# EAGLE design havits_crawdaff (EAGLE 9.6.2)
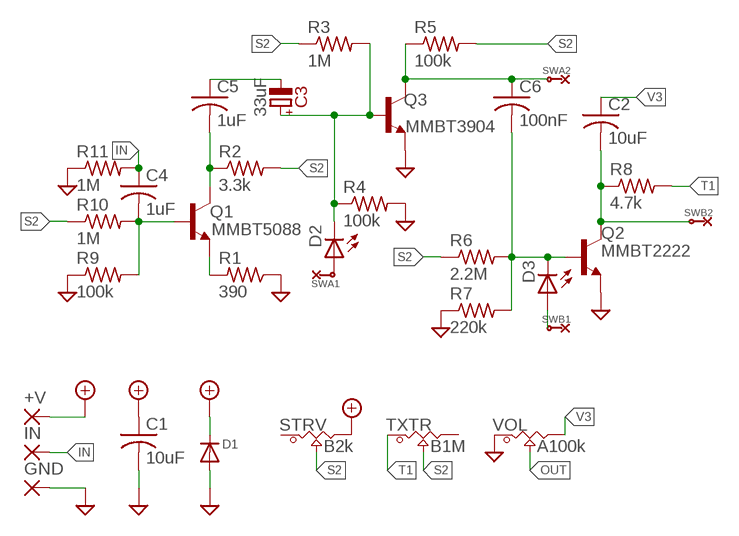
[diagram p0: schematic, sheet 1]

## Parts
+V  SMD2  [SMD1,27-2,54]
C1  10uF  C-USC1206  [C1206]
C2  10uF  C-USC1206  [C1206]
C3  33uF  PAN_B  [PAN_B]
C4  1uF  C-USC0603  [C0603]
C5  1uF  C-USC0603  [C0603]
C6  100nF  C-USC0603  [C0603]
D1  DIODESOD-123  [SOD-123]
D2  LEDCHIPLED_0603  [CHIPLED_0603]
D3  LEDCHIPLED_0603  [CHIPLED_0603]
GND  SMD2  [SMD1,27-2,54]
IN  SMD2  [SMD1,27-2,54]
Q1  MMBT5088  [SOT23-BEC]
Q2  MMBT2222  MMBT2222ALT1-NPN-SOT23-BEC  [SOT23-BEC]
Q3  MMBT3904  MMBT3904LT1G  [SOT23-3]
R1  390  R-US_R0603  [R0603]
R2  3.3k  R-US_R0603  [R0603]
R3  1M  R-US_R0603  [R0603]
R4  100k  R-US_R0603  [R0603]
R5  100k  R-US_R0603  [R0603]
R6  2.2M  R-US_R0603  [R0603]
R7  220k  R-US_R0603  [R0603]
R8  4.7k  R-US_R0603  [R0603]
R9  100k  R-US_R0603  [R0603]
R10  1M  R-US_R0603  [R0603]
R11  1M  R-US_R0603  [R0603]
STRV  B2k  POT_9MM_SMD  [POT_9MM_SMD]
SWA1  COM_SMD  [1PAD]
SWA2  COM_SMD  [1PAD]
SWB1  COM_SMD  [1PAD]
SWB2  COM_SMD  [1PAD]
TXTR  B1M  POT_9MM_SMD  [POT_9MM_SMD]
VOL  A100k  POT_9MM_SMD  [POT_9MM_SMD]

## Nets
+9V: +V.1(P) C1.1 D1.C STRV.3
GND: C1.2 D1.A GND.1(P) Q2.E Q3.2(E) R1.1 R4.2 R7.1 R9.1 R11.1 VOL.1
IN: C4.1 IN.1(P) R11.2
N$2: D3.A SWB1.1
N$4: C3.2-(-) C5.1
N$6: D2.A SWA1.1
OUT: VOL.2
Q1_B: C4.2 Q1.B R9.2 R10.2
Q1_C: C5.2 Q1.C R2.1
Q1_E: Q1.E R1.2
Q2_B: C6.2 D3.C Q2.B R6.2 R7.2
Q2_C: C2.2 Q2.C R8.1 SWB2.1
Q3_B: C3.1+(+) D2.C Q3.1(B) R3.2 R4.1
Q3_C: C6.1 Q3.3(C) R5.1 SWA2.1
S2: R2.2 R3.1 R5.2 R6.1 R10.1 STRV.2 TXTR.2
T1: R8.2 TXTR.1
V3: C2.1 VOL.3
Unconnected: STRV.1 TXTR.3

## Library data of the parts
+V GND IN = wirepad:SMD2: SMD PAD
C1 C2 C4-C6 = adafruit:C-US: CAPACITOR, American symbol
C3 = Panasonic_ECap:PAN_B
D1 = adafruit:DIODE: Diode SMADIODE - SMA Surface Mount Package 20V 1A Schottky Diode Digikey: 641-1014-6-ND DO-1N4148 - Through Hole Small Current Diode SOD-123 20V 1 A (.5mV Vf) Schottky Diode - Digikey: MBRX120TPMSCT-ND SOD-323 10V 570mA (.38mV Vf, 3ns) Schottky Diode - Digikey: ZLLS410CT-ND SOD-523 30V 30mA Schottky Diode (RB751S-40TE61) - Digikey: RB751S-40TE61CT-ND SOT23-R/W - SOT23 Package (R = Solder Paste/Reflow Ovens, W = Hand-Soldering) BAT54Film 40V 300mA - Digikey: 497-7162-1-ND
D2 D3 = adafruit:LED: LED OSRAM: - CHIPLED LG R971, LG N971, LY N971, LG Q971, LY Q971, LO R971, LY R971 LH N974, LH R974 LS Q976, LO Q976, LY Q976 LO Q996 - Hyper CHIPLED LW Q18S LB Q993, LB Q99A, LB R99A - SideLED LS A670, LO A670, LY A670, LG A670, LP A670 LB A673, LV A673, LT A673, LW A673 LH A674 LY A675 LS A676, LA A676, LO A676, LY A676, LW A676 LS A679, LY A679, LG A679 - Hyper Micro SIDELED® LS Y876, LA Y876, LO Y876, LY Y876 LT Y87S - SmartLED LW L88C, LW L88S LB L89C, LB L89S, LG L890 LS L89K, LO L89K, LY L89K LS L896, LA L896, LO L896, LY L896 - TOPLED LS T670, LO T670, LY T670, LG T670, LP T670 LSG T670, LSP T670, LSY T670, LOP T670, LYG T670 LG T671, LOG T671, LSG T671 LB T673, LV T673, LT T673, LW T673 LH T674 LS T676, LA T676, LO T676, LY T676, LB T676, LH T676, LSB T676, LW T676 LB T67C, LV T67C, LT T67C, LS T67K, LO T67K, LY T67K, LW E67C LS E67B, LA E67B, LO E67B, LY E67B, LB E67C, LV E67C, LT E67C LW T67C LS T679, LY T679, LG T679 LS T770, LO T770, LY T770, LG T770, LP T770 LB T773, LV T773, LT T773, LW T773 LH T774 LS E675, LA E675, LY E675, LS T675 LS T776, LA T776, LO T776, LY T776, LB T776 LHGB T686 LT T68C, LB T68C - Hyper Mini TOPLED® LB M676 - Mini TOPLED Santana® LG M470 LS M47K, LO M47K, LY M47K Source: http://www.osram.convergy.de/
Q1 = MMBT5088_:MMBT5088*: NPN TRANSISTOR Check prices <https://pricing.snapeda.com/search/part/MMBT5088/?ref=eda>; AVAILABILITY: Good; DESCRIPTION: Bipolar (BJT) Transistor NPN 30V 100mA 50MHz 350mW Surface Mount SOT-23; MF: ON Semiconductor; MP: MMBT5088; PACKAGE: SOT-23-3 Fairchild Semiconductor; PRICE: None; PURCHASE-URL: https://pricing.snapeda.com/search/part/MMBT5088/?ref=eda
Q2 = MusicThingModular:*-NPN-: NPN Transistror BF959 corrected 2008.03.06
Q3 = Transistor:MMBT3904LT1G: TRANS NPN 40V 0.2A SOT23 Manufacturer's datasheet <https://www.onsemi.com/pub/Collateral/MMBT3904LT1-D.PDF>; CREATED_BY: PCBLayout.com; DIGIKEY_PART_NUMBER: MMBT3904LT1GOSTR-ND; MANUFACTURER: ON Semiconductor; MPN: MMBT3904LT1G; PACKAGE: SOT23-3
R1-R11 = adafruit:R-US_: RESISTOR, American symbol
STRV TXTR VOL = Mech_BO_CE_SW:POT_9MM_SMD
SWA1 SWA2 SWB1 SWB2 = Mech_BO_CE_SW:COM_SMD

## Board
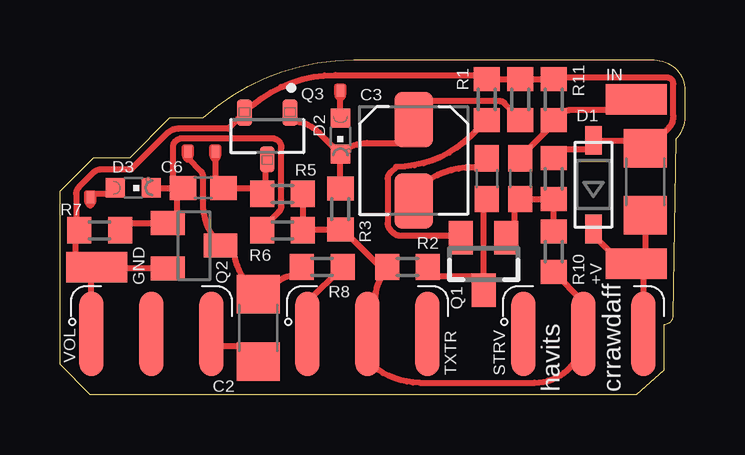
[diagram p1: board, top side]

Size 26.04 x 13.97 mm. Coordinates in mm from the lower left corner, seen from the top.
Outline: 0,1.27 0,8.51 1.4,9.91 2.92,9.91 4.57,11.56 5.97,11.56 arc-42 12.23,13.97 24.77,13.97 arc-90 26.04,12.7 26.04,11.59 arc-45 25.65,10.67 25.53,3.3 arc-89 25.15,2.92 25.15,1.02 24,0 1.27,0 0,1.27
Copper layers (1*16): Top 0.035mm / dielectric 1.5mm / Bottom 0.035mm
Design rules "default *": minimum track width 6mil, minimum drill 0.35mm, track to track 6mil, track to pad 6mil, pad to pad 6mil, via to via 6mil, smd to smd 6mil, copper to edge 10mil, drill to drill 6mil, minimum pad ring 10mil, minimum via ring 8mil, stop-mask expansion 4mil, vias tented up to drill 0mil, thermal gap 10mil

### Footprints (pad centres in the part's own frame; a part is rotated, then mirrored left to right if it is on the bottom)
SMD1,27-2,54 = smd 1.27 x 2.54: 1 0,0
C1206 = smd 1.6 x 1.8: 1 -1.4,0; 2 1.4,0
PAN_B = smd 2.312 x 1.6: 1+ -1.7,0; 2- 1.7,0
C0603 = smd 1.1 x 1: 1 -0.85,0; 2 0.85,0
SOD-123 = smd 1.2 x 0.7: A 1.85,0; C -1.85,0
CHIPLED_0603 = smd 0.8 x 0.8: A 0,-0.75; C 0,0.75
SOT23-BEC = smd 1 x 1.4: B -0.95,-1.1; C 0,1.1; E 0.95,-1.1
SOT23-3 = smd 0.62 x 1.1: 1 -0.95,-0.975; 2 0.95,-0.975; 3 0,0.975
R0603 = smd 1 x 1.1: 1 -0.85,0; 2 0.85,0
POT_9MM_SMD = smd 0.991 x 3.505: 1 -2.5,0; 2 0,0; 3 2.5,0
1PAD = smd 0.31 x 0.5: 1 0,0.267

### Placement (x,y rotation side)
+V  24,5.46 90 top
C1  24.38,8.89 90 top
C2  8.26,2.79 90 top
C3  14.73,9.78 270 top
C4  19.18,9.02 270 top
C5  17.78,9.02 270 top
C6  5.97,8.64 180 top
D1  22.23,8.76 90 top
D2  11.68,10.79 180 top
D3  3.05,8.64 270 top
GND  1.52,5.33 270 top
IN  24,12.32 90 top
Q1  17.65,5.46 180 top
Q2  5.59,6.22 270 top
Q3  8.64,10.79 180 top
R1  17.78,12.32 270 top
R2  14.48,5.33 180 top
R3  11.68,7.75 90 top
R4  19.18,12.32 90 top
R5  9.27,8.38 0 top
R6  9.27,6.86 180 top
R7  1.65,6.86 0 top
R8  10.92,5.33 0 top
R9  20.57,9.02 270 top
R10  20.57,5.97 90 top
R11  20.57,12.32 270 top
STRV  21.81,2.54 0 top
SWA1  11.68,12.95 180 top
SWA2  6.48,10.41 180 top
SWB1  1.27,8.51 180 top
SWB2  5.33,10.41 180 top
TXTR  12.81,2.54 0 top
VOL  3.81,2.54 0 top

### Tracks (layer width: path | path; a pad name or v marks a point on that pad's centre or on a via)
+9V
  Top 0.254: 24.26,5.21 +V.1 24.38,5.84 C1.1 | 24.26,5.21 24.31,5.15 STRV.3 | D1.C 22.23,6.66 23.68,5.21 24.26,5.21
GND
  Top 0.254: R9.1 20.94,10.23 21.97,10.23 22.23,10.49 D1.A 23.75,10.61 arc-45 24.28,10.39 C1.2 24.53,10.29 25.33,11.09 arc45 25.55,11.63 25.55,12.98 arc90 25.3,13.23 20.64,13.23 R11.1 R4.2 R1.1 17.61,13.34 11.48,13.34 arc45 Q3.2 7.02,11.1 4.94,11.1 arc45 4.46,10.9 2.98,9.42 arc-45 2.92,9.4 1.68,9.4 arc45 1.41,9.29 0.79,8.66 arc45 0.67,8.39 0.67,6.99 R7.1 0.64,6.69 0.64,5.46 0.82,5.27 1.58,5.27 | Q2.E 1.58,5.27 | 1.58,5.27 GND.1 1.31,5.12 VOL.1
IN
  Top 0.254: C4.1 19.18,9.91 20.57,11.31 R11.2 20.7,11.47 21.03,11.8 arc-45 21.21,11.87 22.8,11.87 23.24,12.32 IN.1
N$2
  Top 0.254: D3.A 2.16,8.5 2.24,8.37 1.4,8.37 SWB1.1
N$4
  Top 0.254: C3.2- 14.73,8.46 arc-45 17.21,9.49 17.4,9.49 C5.1
N$6
  Top 0.254: D2.A SWA1.1
Q1_B
  Top 0.254: Q1.B 18.92,6.88 18.92,7.91 C4.2 R9.2 R10.2
Q1_C
  Top 0.254: Q1.C 17.65,4.45 | 17.65,4.45 17.65,8.04 C5.2 | 17.65,4.45 17.22,4.88 arc45 17.04,4.95 15.71,4.95 R2.1
Q1_E
  Top 0.254: R1.2 17.11,10.8 arc-45 14,9.51 13.76,9.28 arc45 13.65,9.01 13.65,7.15 arc45 13.76,6.88 13.89,6.75 arc45 14.16,6.64 16.62,6.64 Q1.E
Q2_B
  Top 0.254: D3.C 4.7,8.64 | 4.7,8.64 C6.2 4.87,8.39 4.87,7.55 Q2.B 2.82,7.17 R7.2 | R6.2 8.42,6.94 9.11,7.63 arc45 9.22,7.9 9.22,10.31 arc90 8.84,10.69 5.08,10.69 arc90 4.7,10.31 4.7,8.64
Q2_C
  Top 0.254: SWB2.1 5.33,9.87 5.87,9.33 arc-45 5.95,9.15 5.95,8.01 arc45 Q2.C 7.24,6.22 arc45 7.96,4.49 C2.2 8.55,4.19 9.04,4.68 arc-45 9.69,4.95 R8.1
Q3_B
  Top 0.254: R4.1 19.18,11.52 18.52,12.17 arc45 18.34,12.25 15.5,12.25 C3.1+ 14.73,10.76 arc-90 14.48,10.5 12.79,10.5 arc45 D2.C | R3.2 D2.C | D2.C 10.78,10.95 arc45 9.71,11.39 9.59,11.52 Q3.1
Q3_C
  Top 0.254: Q3.3 8.55,9.73 8.55,8.51 R5.1 8.17,8.64 C6.1 6.48,8.98 SWA2.1
S2
  Top 0.254: R10.1 21.81,3.88 STRV.2 arc-90 19.78,0.51 14.98,0.51 arc-45 12.83,1.4 12.83,2.52 | R5.2 R6.1 10.16,6.9 R3.1 11.77,6.9 13.34,5.33 R2.2 13.63,5.21 arc45 13.12,3.98 13.12,2.82 12.83,2.52 | 12.83,2.52 TXTR.2
T1
  Top 0.254: TXTR.1 10.31,3.87 R8.2
V3
  Top 0.254: VOL.3 6.31,2.03 7.62,2.03 C2.1

### Text on the board
tPlace: havits | crrawdaff